# EAGLE design RTC-Module (EAGLE 6.5.0)
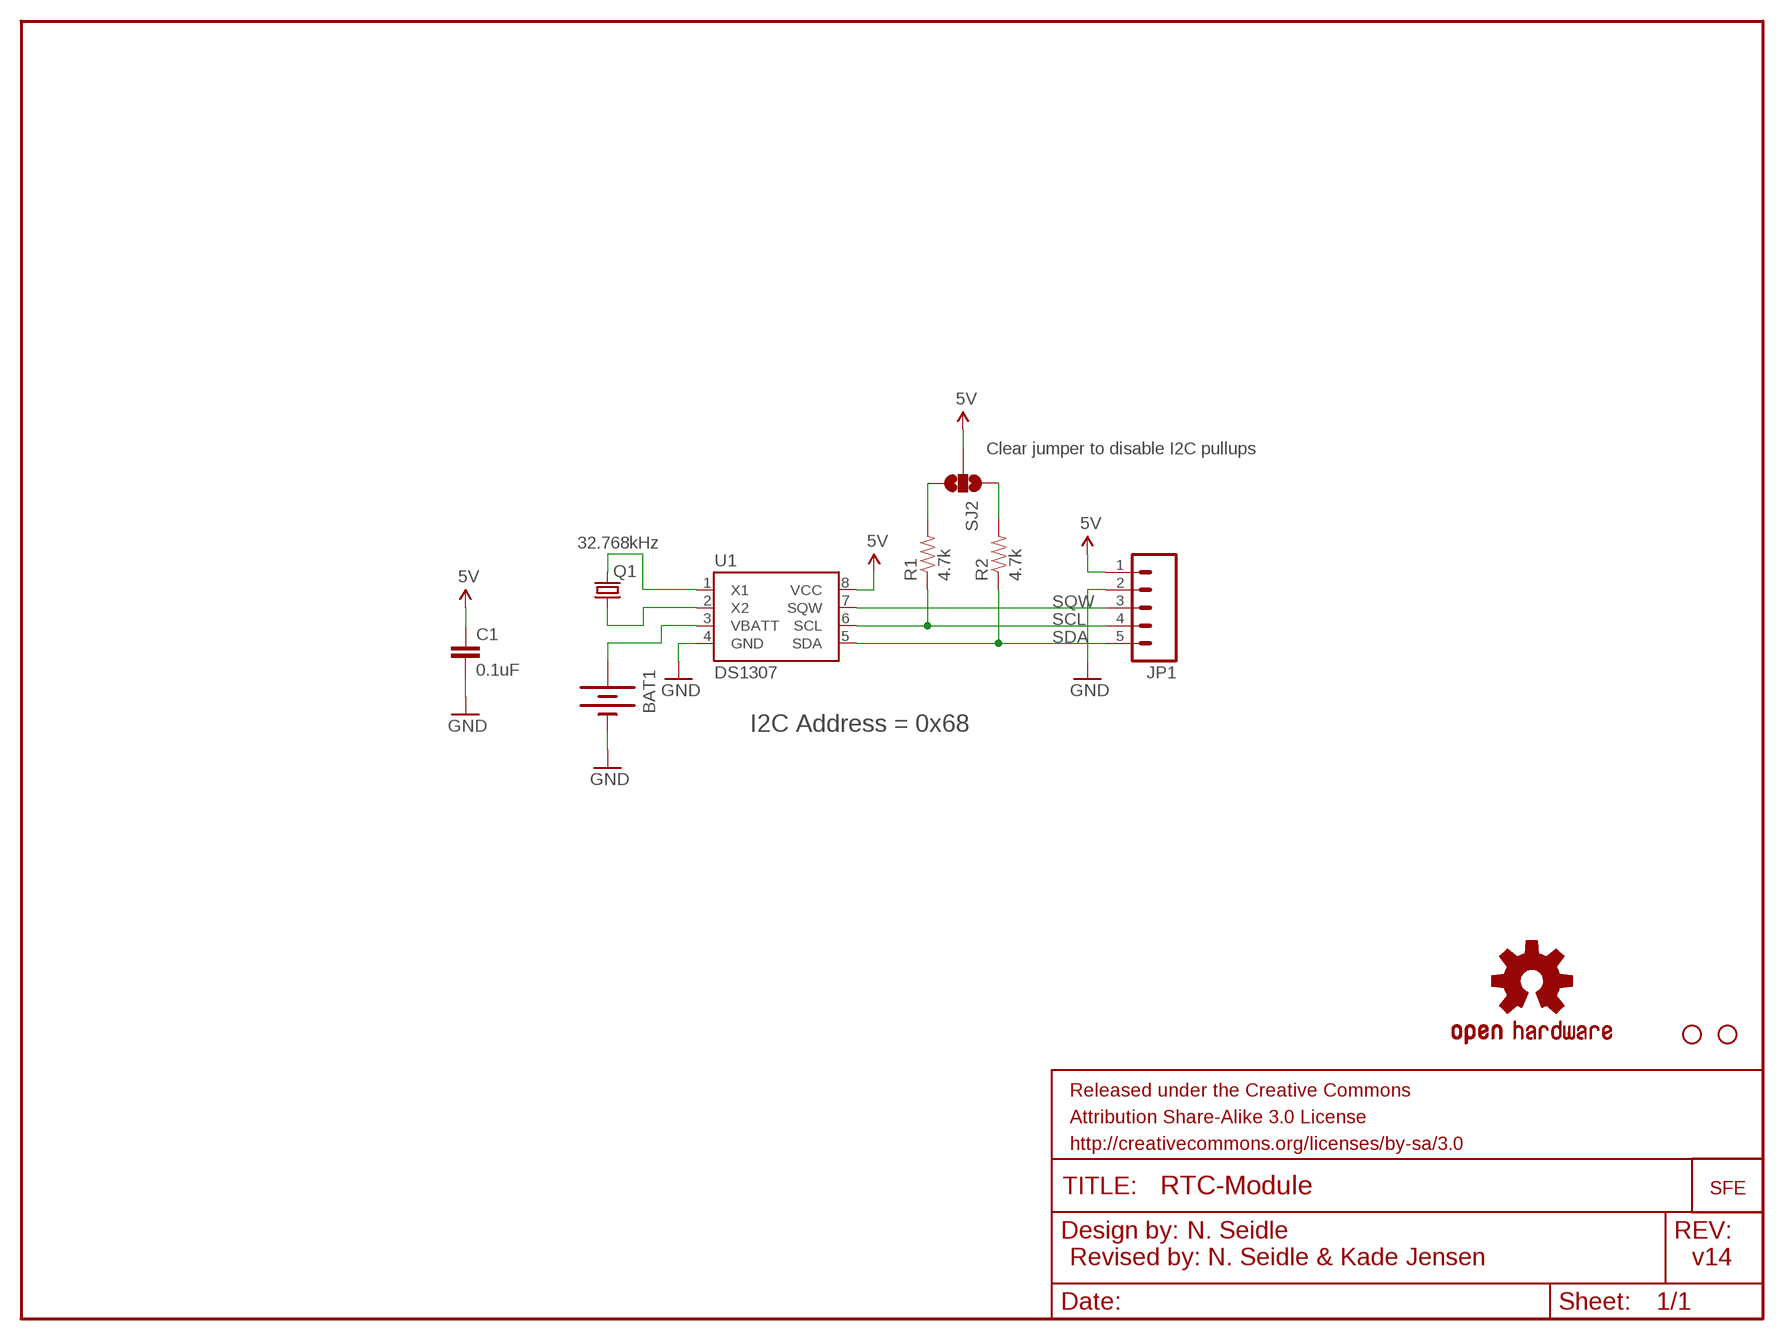
[diagram p0: schematic, sheet 1]

## Parts
BAT1  BATTERY12PTH  [BATTCON_12MM_PTH]
C1  0.1uF  0.1UF-25V(+80/-20%)(0603)  [0603-CAP]
FRAME2  FRAME-LETTER  [CREATIVE_COMMONS]
JP1  M05PTH  [1X05]
LOGO1  OSHW-LOGOS  [OSHW-LOGO-S]
Q1  32.768kHz  CRYSTAL32-SMD  [CRYSTAL-32KHZ-SMD]
R1  4.7k  4.7KOHM1/10W1%(0603)  [0603]
R2  4.7k  4.7KOHM1/10W1%(0603)  [0603]
SJ2  SOLDERJUMPER_2WAYPASTE1&2&3  [SJ_3_PASTE1&2&3]
U1  DS1307  DS1307SO8-TIGHT  [SO08-TIGHT]
U$2  LOGO-SFESK  [SFE-LOGO-FLAME]
U$6  STAND-OFF  [STAND-OFF]
U$7  STAND-OFF  [STAND-OFF]

## Nets
5V: C1.1 JP1.1 SJ2.2 U1.8(VCC)
GND: BAT1.GND(-) C1.2 JP1.2 U1.4(GND)
N$1: Q1.X2 U1.1(X1)
N$2: Q1.X1 U1.2(X2)
N$4: BAT1.VCC@1(+) U1.3(VBATT)
N$5: R1.2 SJ2.3
N$6: R2.2 SJ2.1
SCL: JP1.4 R1.1 U1.6(SCL)
SDA: JP1.5 R2.1 U1.5(SDA)
SQW: JP1.3 U1.7(SQW)

## Notes on the sheet
- Clear jumper to disable I2C pullups
- I2C Address = 0x68
- N. Seidle
- Revised by: N. Seidle & Kade Jensen | v14

## Library data of the parts
BAT1 = SparkFun-Electromechanical:BATTERY: Battery Holders Various common sizes : AA, AAA, 20mm coin cell and 12mm coin cell. 20MM_4LEGS, BATT-10373
C1 = SparkFun-Capacitors:0.1UF-25V(+80/-20%)(0603): CAP-00810 Ceramic Standard decoupling cap; PROD_ID: CAP-00810
FRAME2 = SparkFun-Aesthetics:FRAME-LETTER: Schematic Frame Standard 8.5x11 US Letter frame
JP1 = SparkFun:M05: Header 5 Standard 5-pin 0.1" header. Use with straight break away headers (SKU : PRT-00116), right angle break away headers (PRT-00553), swiss pins (PRT-00743), machine pins (PRT-00117), and female headers (PRT-00115). Molex polarized connector foot print use with SKU : PRT-08230 with associated crimp pins and housings.
LOGO1 = SparkFun-Aesthetics:OSHW-LOGO: Open Source Hardware Logo This logo indicates the piece of hardware it is found on incorporates a OSHW license and/or adheres to the definition of open source hardware found here: http://freedomdefined.org/OSHW
Q1 = SparkFun-FreqCtrl:CRYSTAL: Various standard crystals. Proven footprints. Spark Fun Electronics SKU : COM-00534
R1 R2 = SparkFun-Resistors:4.7KOHM1/10W1%(0603): RES-07857; PROD_ID: RES-07857
SJ2 = SparkFun-Passives:SOLDERJUMPER_2WAY: Solder Jumper 2 way solder jumper
U1 = SparkFun-FreqCtrl:DS1307: I2C real-time clock with battery backup.
U$2 = SparkFun:LOGO-SFE: Spark Fun Electronics PCB Logo This is the standard Spark Fun Electronics PCB logo.
U$6 U$7 = SparkFun:STAND-OFF: Stand Off This is the mechanical footprint for a #4 phillips button head screw. Use the keepout ring to avoid running the screw head into surrounding components. SKU : PRT-00447

## Board
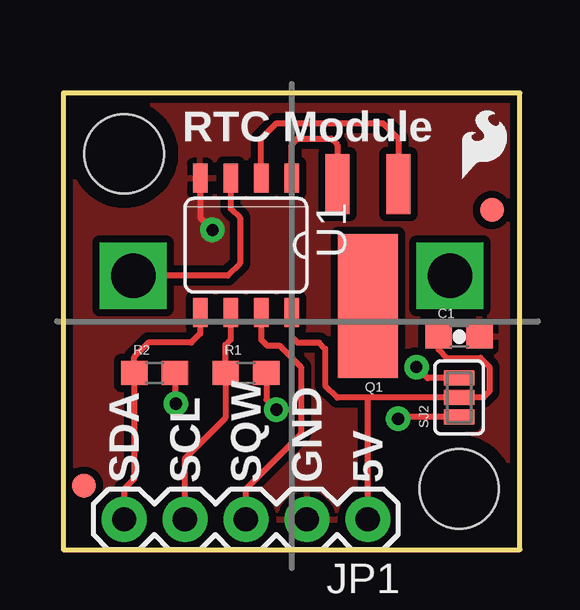
[diagram p1: board, top side]
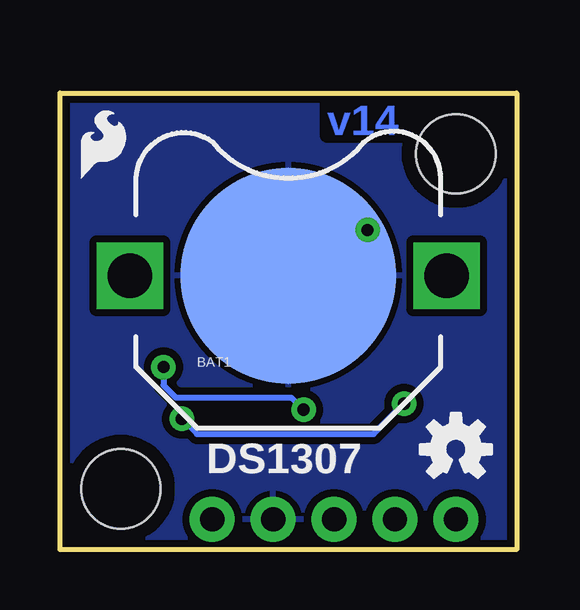
[diagram p2: board, bottom side, seen from below]

Size 19.05 x 19.05 mm. Coordinates in mm from the lower left corner, seen from the top.
Outline: 0,0 19.05,0 19.05,19.05 0,19.05 0,0
Copper layers (1*16): Top 0.035mm / dielectric 1.5mm / Bottom 0.035mm
Design rules "SparkFun-2-layer": minimum track width 7mil, minimum drill 15mil, track to track 8mil, track to pad 8mil, pad to pad 8mil, via to via 8mil, smd to smd 8mil, copper to edge 8mil, drill to drill 8mil, minimum pad ring 12mil, minimum via ring 10mil, stop-mask expansion 4mil, vias tented up to drill 20mil, thermal gap 10mil

### Footprints (pad centres in the part's own frame; a part is rotated, then mirrored left to right if it is on the bottom)
BATTCON_12MM_PTH = smd 9 x 9: GND 0,0 | drill 1.854 square: VCC@1 6.604,0; VCC@2 -6.604,0
0603-CAP = smd 1.1 x 1: 1 -0.85,0; 2 0.85,0
FIDUCIAL-1X2 = smd 1 x 1: 1 0,0
1X05 = drill 1.016 pad 1.88: 1 0,0; 2 2.54,0; 3 5.08,0; 4 7.62,0; 5 10.16,0
CRYSTAL-32KHZ-SMD = smd 2.5 x 6: SHEILD 0,5.08 | smd 1 x 2.5: X1 -1.27,0; X2 1.27,0
0603 = smd 1.1 x 1: 1 -0.85,0; 2 0.85,0
SJ_3_PASTE1&2&3 = smd 0.635 x 1.27: 1 -0.813,0; 2 0,0; 3 0.813,0
SO08-TIGHT = smd 0.6 x 1.2: 1 -1.905,-2.8; 2 -0.635,-2.8; 3 0.635,-2.8; 4 1.905,-2.8; 5 1.905,2.8; 6 0.635,2.8; 7 -0.635,2.8; 8 -1.905,2.8
STAND-OFF = hole 3.302: 0,0

### Placement (x,y rotation side)
BAT1  9.53,11.43 0 bottom
C1  16.51,8.89 0 top
E$1  [FIDUCIAL-1X2]  0.86,2.67 0 top
E$2  [FIDUCIAL-1X2]  17.88,14.17 0 top
FRAME2  21.59,-15.24 0 top  (outside the outline)
JP1  12.7,1.27 180 top
LOGO1  2.54,4.19 0 bottom
Q1  12.7,15.24 180 top
R1  7.62,7.37 0 top
R2  3.81,7.37 0 top
SJ2  16.51,6.35 90 top
U1  7.62,12.7 180 top
U$1  LOGO-SFESK  [SFE-LOGO-FLAME]  16.64,15.49 0 top
U$2  18.16,15.49 0 bottom
U$6  16.51,2.54 0 top
U$7  2.54,16.51 0 top

### Tracks (layer width: path | path; a pad name or v marks a point on that pad's centre or on a via)
5V
  Top 0.254: U1.8 9.53,8.89 9.78,8.64 10.67,8.64 10.92,8.38 10.92,6.86 11.43,6.35 12.7,6.35 | 12.7,6.35 SJ2.2 17.53,6.35 17.78,6.6 17.78,7.62 17.4,8 16,8 15.66,8.34 C1.1 | JP1.1 12.7,6.35
GND  (via drill 0.51)
  Top 0.254: U1.4 5.71,13.84 v6.22,13.34
  Bottom 0.254: BAT1.GND 8.13,11.43 v6.22,13.34
  pour Bottom (isolate 0.305): 0,0 0,19.05 19.05,19.05 19.05,0
  pour Top (isolate 0.305): 0,19.05 0,0 19.05,0 19.05,19.05
N$1
  Top 0.254: U1.1 9.53,16.89 9.78,17.14 11.18,17.14 11.43,16.89 Q1.X2
N$2
  Top 0.254: 8.26,15.37 U1.2 8.26,17.14 8.89,17.78 13.34,17.78 13.97,17.14 Q1.X1
N$4
  Top 0.254: U1.3 6.99,14.22 7.37,13.84 7.37,11.94 6.86,11.43 BAT1.VCC@1
N$5  (via drill 0.51)
  Top 0.254: SJ2.3 15.19,7.16 v14.73,7.62 | R1.2 8.47,6.26 v8.89,5.84
  Bottom 0.254: v14.73,7.62 14.73,6.86 14.22,6.35 9.4,6.35 v8.89,5.84
N$6  (via drill 0.51)
  Top 0.254: SJ2.1 14.05,5.54 v13.97,5.46 | R2.2 4.66,6.13 v4.7,6.1
  Bottom 0.254: v13.97,5.46 13.34,4.83 5.97,4.83 v4.7,6.1
SCL
  Top 0.254: JP1.4 5.08,3.81 6.77,5.5 R1.1 6.77,8.55 6.99,8.76 U1.6
SDA
  Top 0.254: JP1.5 2.54,2.54 2.96,2.96 R2.1 2.96,8.04 3.56,8.64 5.33,8.64 5.71,9.02 U1.5
SQW
  Top 0.254: JP1.3 7.62,2.54 9.91,4.83 9.91,7.62 9.02,8.51 8.51,8.51 8.26,8.76 U1.7

### Text on the board
Bottom: v14
tPlace: RTC Module | SDA | SCL | SQW | GND | 5V
bPlace: DS1307
tValues: .1 uF
tDocu: N. Seidle | Revised by: N. Seidle & Kade Jensen